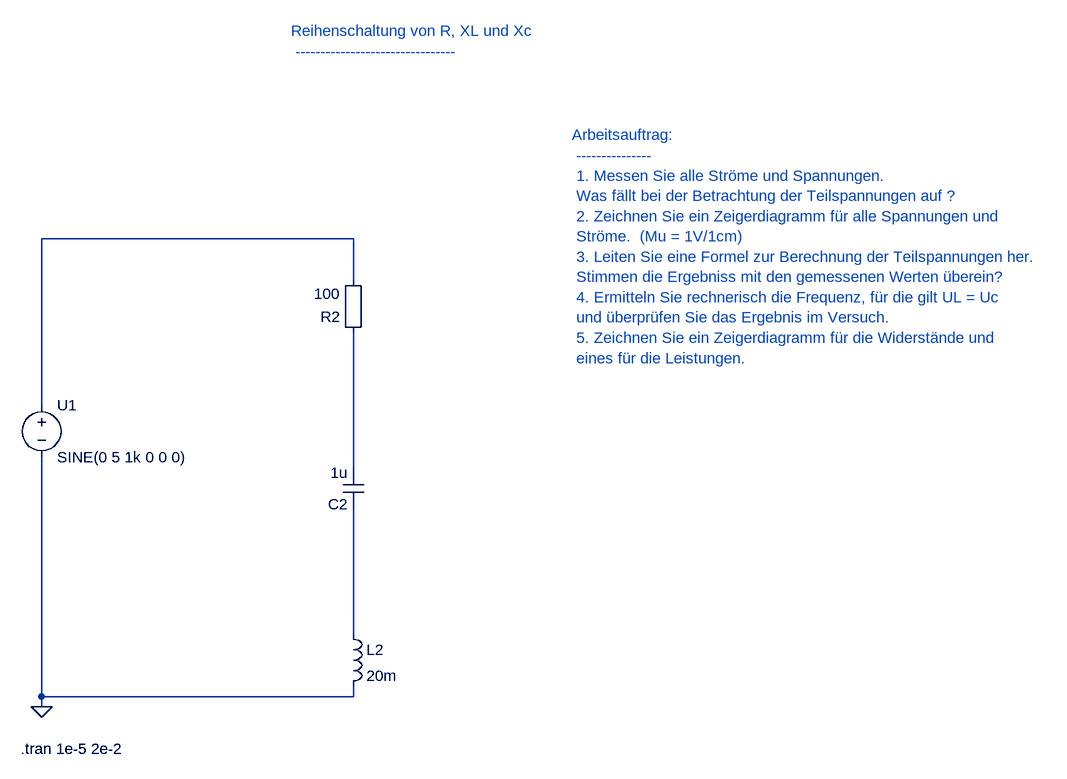
[diagram p0: schematic 15_1_Schaltungen_von_R_Xc_XL.asc]
15_1_Schaltungen_von_R_Xc_XL.asc, the LTspice schematic file:
Version 4
SHEET 1 880 680
WIRE 96 720 96 736
WIRE 576 736 576 720
WIRE 96 640 96 384
WIRE 96 384 576 384
WIRE 576 384 576 448
WIRE 576 528 576 720
WIRE 576 992 576 800
WIRE 96 736 96 1088
WIRE 96 1088 96 1104
WIRE 576 1072 576 1088
WIRE 576 1088 96 1088
FLAG 96 1104 0
SYMBOL voltage 96 624 R0
SYMATTR InstName U1
SYMATTR Value SINE(0 5 1k 0 0 0)
SYMBOL Misc\EuropeanResistor 592 544 R180
SYMATTR InstName R2
SYMATTR Value 100
SYMBOL cap 592 800 R180
SYMATTR InstName C2
SYMATTR Value 1u
SYMBOL ind 560 976 R0
SYMATTR InstName L2
SYMATTR Value 20m
TEXT 64 1168 Left 2 !.tran 1e-5 2e-2
TEXT 480 64 Left 2 ;Reihenschaltung von R, XL und Xc \n --------------------------------
TEXT 912 224 Left 2 ;Arbeitsauftrag: \n --------------- \n 1. Messen Sie alle Ströme und Spannungen. \n Was fällt bei der Betrachtung der Teilspannungen auf ? \n 2. Zeichnen Sie ein Zeigerdiagramm für alle Spannungen und \n Ströme.  (Mu = 1V/1cm) \n 3. Leiten Sie eine Formel zur Berechnung der Teilspannungen her. \n Stimmen die Ergebniss mit den gemessenen Werten überein? \n 4. Ermitteln Sie rechnerisch die Frequenz, für die gilt UL = Uc \n und überprüfen Sie das Ergebnis im Versuch. \n 5. Zeichnen Sie ein Zeigerdiagramm für die Widerstände und \n eines für die Leistungen.

The netlist it stands for:
* 15_1_Schaltungen_von_R_Xc_XL.asc
V§U1 N002 0 SINE(0 5 1k 0 0 0)
R2 N001 N002 100
C2 N003 N001 1u
L2 N003 0 20m
.tran 1e-5 2e-2
* Reihenschaltung von R, XL und Xc
*  --------------------------------
* Arbeitsauftrag:
*  ---------------
*  1. Messen Sie alle Ströme und Spannungen.
*  Was fällt bei der Betrachtung der Teilspannungen auf ?
*  2. Zeichnen Sie ein Zeigerdiagramm für alle Spannungen und
*  Ströme.  (Mu = 1V/1cm)
*  3. Leiten Sie eine Formel zur Berechnung der Teilspannungen her.
*  Stimmen die Ergebniss mit den gemessenen Werten überein?
*  4. Ermitteln Sie rechnerisch die Frequenz, für die gilt UL = Uc
*  und überprüfen Sie das Ergebnis im Versuch.
*  5. Zeichnen Sie ein Zeigerdiagramm für die Widerstände und
*  eines für die Leistungen.
.backanno
.end